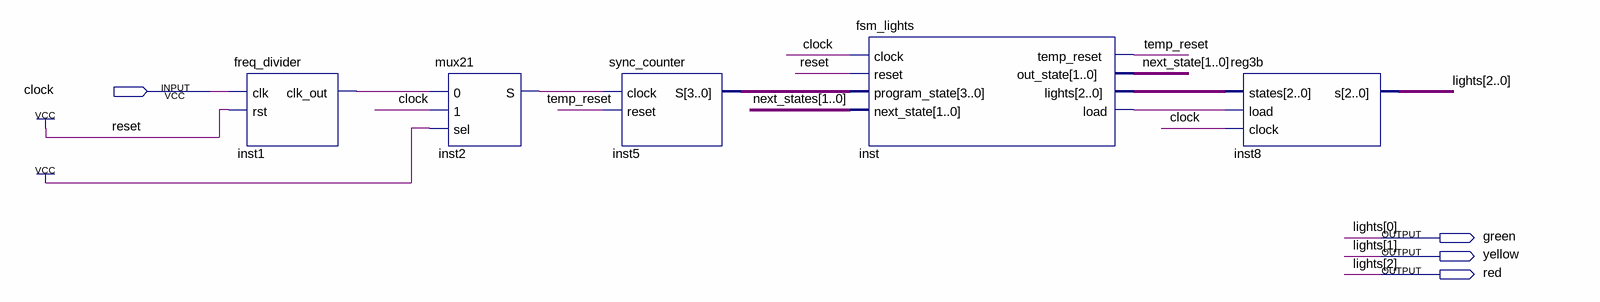
[diagram p0: schematic sheet]
// Quartus schematic TrafficLights.bdf as structural Verilog: 5 symbols, 4 pins
module TrafficLights (
  input  clock,
  output green,
  output yellow,
  output red
);

  wire inst1_clk_out, inst2_s, inst_load, temp_reset;
  wire [1:0] next_state, next_states;
  wire [2:0] inst_lights;
  wire [3:0] inst5_s;

  freq_divider inst1 (.clk(clock), .rst(1'b1), .clk_out(inst1_clk_out));
  mux21 inst2 (.\0 (inst1_clk_out), .\1 (clock), .sel(1'b1), .S(inst2_s));
  sync_counter inst5 (.clock(inst2_s), .reset(temp_reset), .S(inst5_s));
  fsm_lights inst (
    .clock(clock), .reset(1'b1), .program_state(inst5_s), .next_state(next_states), .temp_reset(temp_reset),
    .out_state(next_state), .lights(inst_lights), .load(inst_load));
  reg3b inst8 (.states(inst_lights), .load(inst_load), .clock(clock), .s({red, yellow, green}));

  // Other names for the same wires on the sheet: lights[2:0] = {red, yellow, green}
endmodule
